# Altium schematic sheet JHZ-E01S-HW-Sensor-X3-S0.1-光编码avago-20160919.SchDoc
size A4
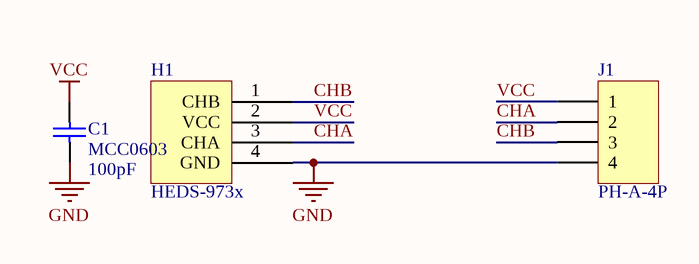
[diagram p0: JHZ-E01S-HW-Sensor-X3-S0.1-光编码avago-20160919.SchDoc]

## Parts
C1  MCC0603  value 100pF  [C0603_M1608]
H1  HEDS-973x  [HEDS-973x]
J1  PH-A-4P  [PH-A-4P]

## Nets
GND: C1.2 H1.4(GND) J1.4
VCC: C1.1 H1.2(VCC) J1.1
CHA: H1.3(CHA) J1.2
CHB: H1.1(CHB) J1.3

## Library data of the parts
C1 = MCC0603: Multilayer Ceramic Capacitor 0603
J1 = PH-A-4P: Header, 2.0mm,4-Pin; Value: PH-A-4P